# EAGLE design Catdoor-TwoMosfet-FeatherWing (EAGLE 8.3.2)
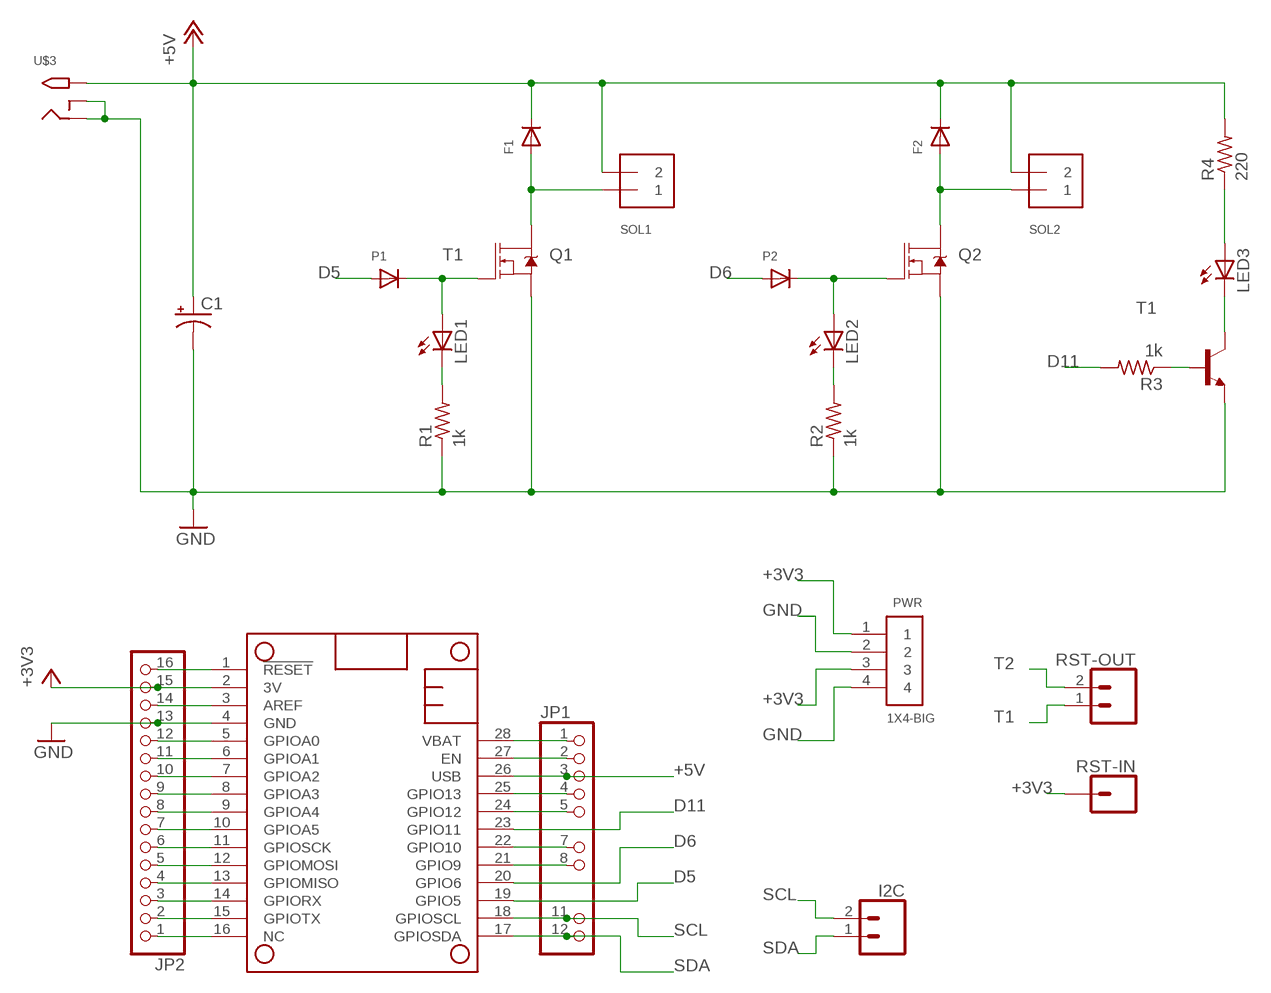
[diagram p0: schematic, sheet 1]

## Parts
C1  CPOL-USE5-13  [E5-13]
F1  DIODELONG-SPACING  [DIODE-LONG]
F2  DIODELONG-SPACING  [DIODE-LONG]
I2C  CONN_02  [1X02]
JP1  PINHD-1X12-CB  [1X12-CB]
JP2  HEADER-1X16ROUND  [1X16_ROUND]
LED1  LED3MM  [LED3MM]
LED2  LED3MM  [LED3MM]
LED3  LED3MM  [LED3MM]
MS1  FEATHERWING  [FEATHERWING]
P1  DIODELONG-SPACING  [DIODE-LONG]
P2  DIODELONG-SPACING  [DIODE-LONG]
PWR  1X4-BIG  [1X04-BIG]
Q1  MOSFET-NCH-FQP30N06L  [TO220V]
Q2  MOSFET-NCH-FQP30N06L  [TO220V]
R1  1k  R-US_0204/7  [0204/7]
R2  1k  R-US_0204/7  [0204/7]
R3  1k  R-US_0204/7  [0204/7]
R4  220  R-US_0204/7  [0204/7]
RST-IN  CONN_01  [1X01]
RST-OUT  CONN_02  [1X02]
SOL1  TERMBLOCK_1X2  [TERMBLOCK_1X2-3.5MM]
SOL2  TERMBLOCK_1X2  [TERMBLOCK_1X2-3.5MM]
T1  2N2222  [TO92-EBC-OVAL]
U$3  2.1MMJACKTHM  [PJ-102A]

## Nets
+3V3: JP2.15 MS1.2(3V) PWR.1 PWR.3 RST-IN.1
+5V: C1.+ F1.C F2.C JP1.3 MS1.26(USB) R4.2 SOL1.2 SOL2.2 U$3.TIP
D5: MS1.19(GPIO5) P1.A
D6: MS1.20(GPIO6) P2.A
D11: MS1.23(GPIO11) R3.2
GND: C1.- JP2.13 MS1.4(GND) PWR.2 PWR.4 Q1.3(S) Q2.3(S) R1.1 R2.1 T1.E U$3.RING U$3.RING_SW
N$1: JP1.2 MS1.27(EN)
N$2: JP1.4 MS1.25(GPIO13)
N$3: LED3.A R4.1
N$4: LED1.K(C) R1.2
N$5: JP1.5 MS1.24(GPIO12)
N$6: LED3.K(C) T1.C
N$7: R3.1 T1.B
N$9: LED2.K(C) R2.2
N$10: JP1.7 MS1.22(GPIO10)
N$11: JP1.8 MS1.21(GPIO9)
N$18: JP2.1 MS1.16(NC)
N$19: JP2.2 MS1.15(GPIOTX)
N$20: JP2.3 MS1.14(GPIORX)
N$21: JP2.4 MS1.13(GPIOMISO)
N$22: JP2.5 MS1.12(GPIOMOSI)
N$23: JP2.6 MS1.11(GPIOSCK)
N$24: JP2.7 MS1.10(GPIOA5)
N$25: JP2.8 MS1.9(GPIOA4)
N$26: JP2.9 MS1.8(GPIOA3)
N$27: JP2.10 MS1.7(GPIOA2)
N$28: JP2.11 MS1.6(GPIOA1)
N$29: JP2.12 MS1.5(GPIOA0)
N$30: JP2.14 MS1.3(AREF)
N$32: JP2.16 MS1.1(!RESET)
S1: F1.A Q1.2(D) SOL1.1
S2: F2.A Q2.2(D) SOL2.1
SCL: I2C.2 JP1.11 MS1.18(GPIOSCL)
SDA: I2C.1 JP1.12 MS1.17(GPIOSDA)
T1: LED1.A P1.C Q1.1(G) RST-OUT.1
T2: LED2.A P2.C Q2.1(G) RST-OUT.2
VBAT: JP1.1 MS1.28(VBAT)

## Library data of the parts
C1 = adafruit:CPOL-US: POLARIZED CAPACITOR, American symbol
F1 F2 P1 P2 = flupes:DIODE: Diode SMADIODE - SMA Surface Mount Package 20V 1A Schottky Diode Digikey: 641-1014-6-ND DO-1N4148 - Through Hole Small Current Diode SOD-123 20V 1 A (.5mV Vf) Schottky Diode - Digikey: MBRX120TPMSCT-ND SOD-323 10V 570mA (.38mV Vf, 3ns) Schottky Diode - Digikey: ZLLS410CT-ND SOD-523 30V 30mA Schottky Diode (RB751S-40TE61) - Digikey: RB751S-40TE61CT-ND SOT23-R/W - SOT23 Package (R = Solder Paste/Reflow Ovens, W = Hand-Soldering) BAT54Film 40V 300mA - Digikey: 497-7162-1-ND
I2C RST-OUT = SparkFun-Connectors:CONN_02: Multi connection point. Often used as Generic Header-pin footprint for 0.1 inch spaced/style header connections On any of the 0.1 inch spaced packages, you can populate with these: Break Away Headers - Straight <https://www.sparkfun.com/products/116> (PRT-00116) Break Away Male Headers - Right Angle <https://www.sparkfun.com/products/553> (PRT-00553) Female Headers <https://www.sparkfun.com/products/115> (PRT-00115) Break Away Headers - Machine Pin <https://www.sparkfun.com/products/117> (PRT-00117) Break Away Female Headers - Swiss Machine Pin <https://www.sparkfun.com/products/743> (PRT-00743) For SCREWTERMINALS and SPRING TERMINALS visit here: Screw Terimnals on SparkFun.com <https://www.sparkfun.com/search/results?term=Screw+Terminals> (5mm/3.5mm/2.54mm spacing) This device is also useful as a general connection point to wire up your design to another part of your project. Our various solder wires solder well into these plated through hole pads. Hook-Up Wire - Assortment (Stranded, 22 AWG) <https://www.sparkfun.com/products/11375> (PRT-11375) Hook-Up Wire - Assortment (Solid Core, 22 AWG) <https://www.sparkfun.com/products/11367> (PRT-11367) View the entire wire category on our website here <https://www.sparkfun.com/categories/141> Special notes: Molex polarized connector foot print use with: PRT-08233 with associated crimp pins and housings. 2.54_SCREWTERM for use with PRT-10571. 3.5mm Screw Terminal footprints for PRT-08084 5mm Screw Terminal footprints for use with PRT-08432
JP1 = flupes:PINHD-1X12: PIN HEADER
JP2 = microbuilder:HEADER-1X16: PIN HEADER
LED1-LED3 = adafruit:LED: LED OSRAM: - CHIPLED LG R971, LG N971, LY N971, LG Q971, LY Q971, LO R971, LY R971 LH N974, LH R974 LS Q976, LO Q976, LY Q976 LO Q996 - Hyper CHIPLED LW Q18S LB Q993, LB Q99A, LB R99A - SideLED LS A670, LO A670, LY A670, LG A670, LP A670 LB A673, LV A673, LT A673, LW A673 LH A674 LY A675 LS A676, LA A676, LO A676, LY A676, LW A676 LS A679, LY A679, LG A679 - Hyper Micro SIDELED® LS Y876, LA Y876, LO Y876, LY Y876 LT Y87S - SmartLED LW L88C, LW L88S LB L89C, LB L89S, LG L890 LS L89K, LO L89K, LY L89K LS L896, LA L896, LO L896, LY L896 - TOPLED LS T670, LO T670, LY T670, LG T670, LP T670 LSG T670, LSP T670, LSY T670, LOP T670, LYG T670 LG T671, LOG T671, LSG T671 LB T673, LV T673, LT T673, LW T673 LH T674 LS T676, LA T676, LO T676, LY T676, LB T676, LH T676, LSB T676, LW T676 LB T67C, LV T67C, LT T67C, LS T67K, LO T67K, LY T67K, LW E67C LS E67B, LA E67B, LO E67B, LY E67B, LB E67C, LV E67C, LT E67C LW T67C LS T679, LY T679, LG T679 LS T770, LO T770, LY T770, LG T770, LP T770 LB T773, LV T773, LT T773, LW T773 LH T774 LS E675, LA E675, LY E675, LS T675 LS T776, LA T776, LO T776, LY T776, LB T776 LHGB T686 LT T68C, LB T68C - Hyper Mini TOPLED® LB M676 - Mini TOPLED Santana® LG M470 LS M47K, LO M47K, LY M47K Source: http://www.osram.convergy.de/
MS1 = microbuilder:FEATHERWING
PWR = adafruit:1X4: 4-pin connector
Q1 Q2 = SparkFun-DiscreteSemi:MOSFET-NCH: N-channel MOSFETs Voltage controlled devices that allow control of high current outputs. SparkFun Products: SparkFun OpenScale <https://www.sparkfun.com/products/13261> SparkFun Digital Sandbox <https://www.sparkfun.com/products/12651> SparkFun Monster Moto Shield <https://www.sparkfun.com/products/10182> SparkFun MOSFET Power Controller <https://www.sparkfun.com/products/11214>; PROD_ID: TRANS-10060; VALUE: 60V/32A/35mΩ
R1-R4 = adafruit:R-US_: RESISTOR, American symbol
RST-IN = SparkFun-Connectors:CONN_01: Single connection point. Often used as Generic Header-pin footprint for 0.1 inch spaced/style header connections On any of the 0.1 inch spaced packages, you can populate with these: Break Away Headers - Straight <https://www.sparkfun.com/products/116> (PRT-00116) Break Away Male Headers - Right Angle <https://www.sparkfun.com/products/553> (PRT-00553) Female Headers <https://www.sparkfun.com/products/115> (PRT-00115) Break Away Headers - Machine Pin <https://www.sparkfun.com/products/117> (PRT-00117) Break Away Female Headers - Swiss Machine Pin <https://www.sparkfun.com/products/743> (PRT-00743) This device is also useful as a general connection point to wire up your design to another part of your project. Our various solder wires solder well into these plated through hole pads. Hook-Up Wire - Assortment (Stranded, 22 AWG) <https://www.sparkfun.com/products/11375> (PRT-11375) Hook-Up Wire - Assortment (Solid Core, 22 AWG) <https://www.sparkfun.com/products/11367> (PRT-11367) View the entire wire category on our website here <https://www.sparkfun.com/categories/141> Special notes: SMTSO-256-ET is a "flush mount" nut for a 4-40 screw. We mostly use this on specialty testbeds; it is a nice way to connect hardware to your PCB at an adjustable hieght. Also note, the SNAP packages are for using a snappable style connector. We sell a baggie of snaps and they are also used on two LilyPad designs: Snap Assortment - 30 pack (male and female) <https://www.sparkfun.com/products/11347> (DEV-11347) LilyPad Arduino SimpleSnap <https://www.sparkfun.com/products/10941> (DEV-10941) LilyPad SimpleSnap Protoboard <https://www.sparkfun.com/products/10940> (DEV-10940)
SOL1 SOL2 = microbuilder:TERMBLOCK_1X2: 3.5mm Terminal block http://www.ladyada.net/library/pcb/eaglelibrary.html
T1 = adafruit:2N2222: NPN TRANSISTOR Big oval pads
U$3 = adafruit:2.1MMJACK: 2.1mm x 5.5mm THM DC jack with internal switch. Digikey part #PJ-102A, 4UCON part #05537 2.1mm x 5.5mm SMT DC jack with internal switch. Digikey part #PJ-002A-SMT, 4UCON part #03267 By microbuilder.eu & adafruit.com

## Board
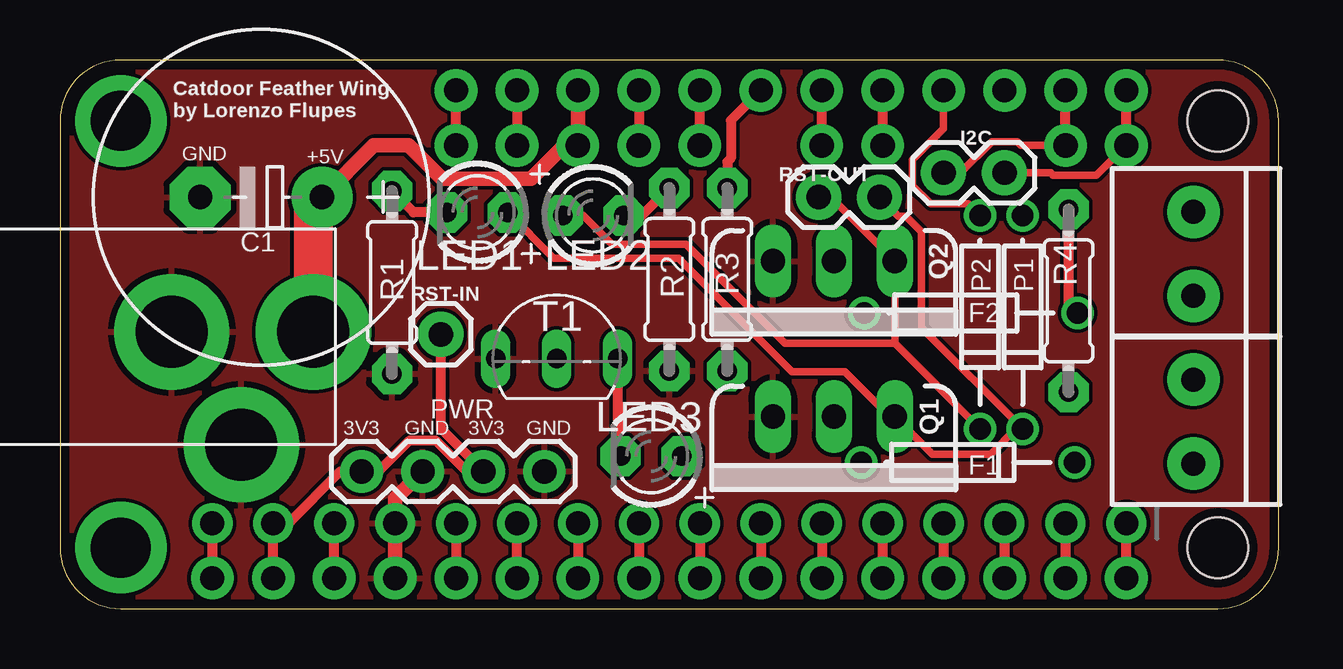
[diagram p1: board, top side]
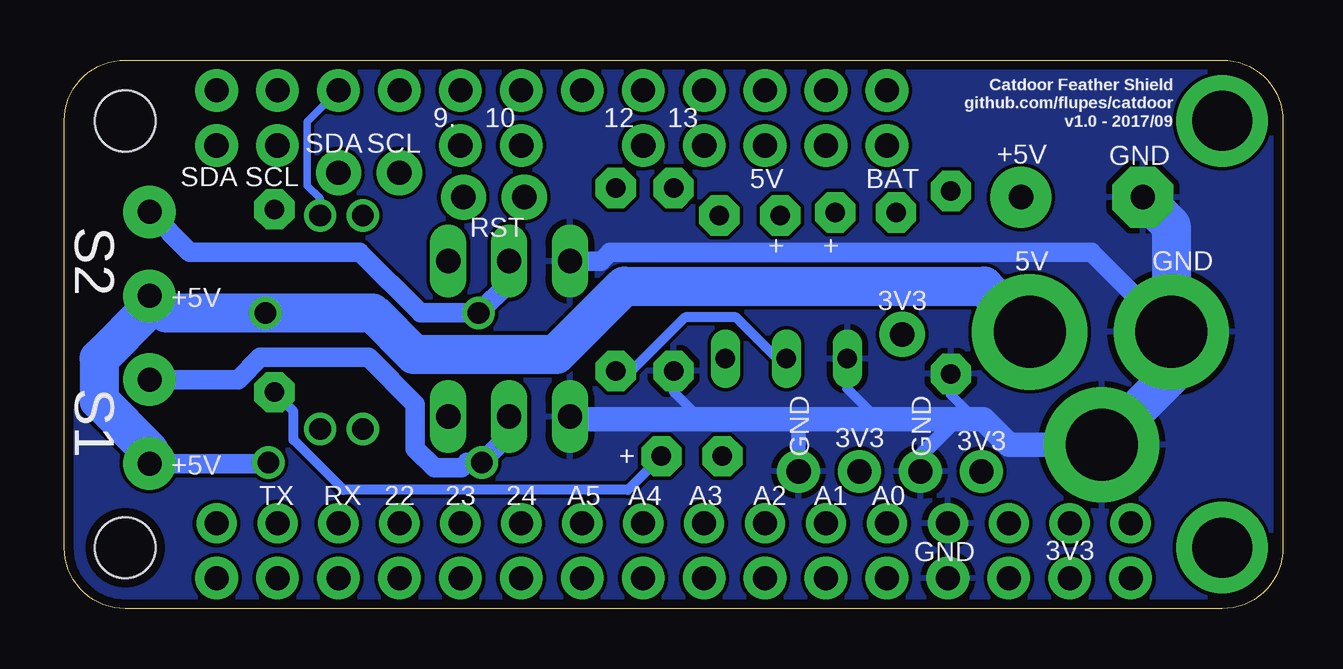
[diagram p2: board, bottom side, seen from below]

Size 50.8 x 22.86 mm. Coordinates in mm from the lower left corner, seen from the top.
Copper layers (1*16): Top 0.0356mm / dielectric 1.5011mm / Bottom 0.0356mm
Design rules "oshpark-2layer": minimum track width 6mil, minimum drill 13mil, track to track 6mil, track to pad 6mil, pad to pad 6mil, via to via 6mil, smd to smd 6mil, copper to edge 15mil, drill to drill 6mil, minimum pad ring 7mil, minimum via ring 7mil, stop-mask expansion 2.5mil, vias tented up to drill 0mil, thermal gap 10mil

### Footprints (pad centres in the part's own frame; a part is rotated, then mirrored left to right if it is on the bottom)
E5-13 = drill 1.016 pad 2.54: + -2.54,0 | drill 1.016 pad 2.54 octagon: - 2.54,0
DIODE-LONG = drill 0.9: A -3.81,0; C 5.08,0
1X02 = drill 1.016 pad 1.88: 1 0,0; 2 2.54,0
1X12-CB = drill 1.016 pad 1.778: 1 -13.97,0; 2 -11.43,0; 3 -8.89,0; 4 -6.35,0; 5 -3.81,0; 7 1.27,0; 8 3.81,0; 11 11.43,0; 12 13.97,0
1X16_ROUND = drill 1 pad 1.676: 1 -19.05,0; 2 -16.51,0; 3 -13.97,0; 4 -11.43,0; 5 -8.89,0; 6 -6.35,0; 7 -3.81,0; 8 -1.27,0; 9 1.27,0; 10 3.81,0; 11 6.35,0; 12 8.89,0; 13 11.43,0; 14 13.97,0; 15 16.51,0; 16 19.05,0
LED3MM = drill 0.813 pad 1.676 octagon: A -1.27,0; K 1.27,0
FEATHERWING = drill 1 pad 1.778: 1 6.35,1.27; 2 8.89,1.27; 3 11.43,1.27; 4 13.97,1.27; 5 16.51,1.27; 6 19.05,1.27; 7 21.59,1.27; 8 24.13,1.27; 9 26.67,1.27; 10 29.21,1.27; 11 31.75,1.27; 12 34.29,1.27; 13 36.83,1.27; 14 39.37,1.27; 15 41.91,1.27; 16 44.45,1.27; 17 44.45,21.59; 18 41.91,21.59; 19 39.37,21.59; 20 36.83,21.59; 21 34.29,21.59; 22 31.75,21.59; 23 29.21,21.59; 24 26.67,21.59; 25 24.13,21.59; 26 21.59,21.59; 27 19.05,21.59; 28 16.51,21.59 | drill 2.5 pad 3.81: P$1 2.54,20.32; P$2 2.54,2.54 | hole 2.54: 48.26,20.32; 48.26,2.54
1X04-BIG = drill 1.016 pad 1.778: 1 0,0; 2 2.54,0; 3 5.08,0; 4 7.62,0
TO220V = drill 1.016 long: 1 -2.54,0; 2 0,0; 3 2.54,0
0204/7 = drill 0.813 pad 1.676 octagon: 1 -3.81,0; 2 3.81,0
1X01 = drill 1.016 pad 1.88: 1 0,0
TERMBLOCK_1X2-3.5MM = drill 1 pad 2.184: 1 1.8,0; 2 -1.7,0
TO92-EBC-OVAL = drill 0.813 long: B 0,-1.27; C 2.54,-1.27; E -2.54,-1.27
PJ-102A = drill 3 pad 4.8: RING 0.1,-3.39; RING_SW -4.6,-6.29; TIP 0.1,-9.29

### Placement (x,y rotation side)
C1  8.38,17.14 180 top
F1  37.21,6.1 0 top
F2  37.34,12.32 0 top
I2C  39.37,18.16 180 top
JP1  30.48,19.3 0 top
JP2  25.4,3.56 180 top
LED1  17.4,16.51 180 top
LED2  22.23,16.38 0 top
LED3  24.64,6.35 180 top
MS1  0,0 0 top
P1  40.13,12.57 270 top
P2  38.35,12.57 270 top
PWR  12.57,5.71 0 top
Q1  32.26,8 180 top
Q2  32.26,14.48 180 top
R1  13.84,13.59 90 top
R2  25.4,13.72 90 top
R3  27.81,13.72 90 top
R4  42.04,12.83 90 top
RST-IN  15.88,11.43 0 top
RST-OUT  34.16,17.14 180 top
SOL1  47.24,7.75 90 top
SOL2  47.24,14.73 90 top
T1  20.7,11.68 0 top
U$3  1.27,11.43 90 top

### Tracks (layer width: path | path; a pad name or v marks a point on that pad's centre or on a via)
+3V3
  Top 0.406: MS1.2 JP2.15 9.53,3.56 11.68,5.71 PWR.1 13.28,5.71 14.58,7.01 15.65,7.01 16.95,5.71 PWR.3 15.88,7.49 RST-IN.1
+5V
  Top 0.406: R4.2 42.04,12.7 F2.C
  Top 0.61: MS1.26 JP1.3 21.03,19.3 19.63,17.91 15.93,17.91 14.53,19.3 13.08,19.3 C1.+
  Top 1.626: C1.+ 10.56,16.78 U$3.TIP
  Bottom 0.813: F1.C 42.34,6.05 SOL1.2
  Bottom 1.626: U$3.TIP 12.47,13.44 27.46,13.44 30.3,10.6 36.23,10.6 37.95,12.32 F2.C 46.53,12.32 SOL2.2 47.24,12.53 49.35,10.42 49.35,8.67 47.24,6.57 SOL1.2
D5
  Bottom 0.305: P1.A 40.13,17.09 40.66,17.62 40.66,20.3 MS1.19
D6
  Top 0.305: P2.A 37.87,16.87 36.29,16.87 35.53,17.62 35.53,18.7 36.83,19.99 MS1.20
D11
  Top 0.406: R3.2 27.81,18.61 27.96,18.77 27.96,20.34 MS1.23
GND
  Top 0.61: MS1.4 JP2.13 13.97,4.57 PWR.2
  Bottom 0.406: R1.1 13.84,8.91 12.83,7.9 | R2.1 25.4,9.04 24.26,7.9 | T1.E 18.16,9.17 16.89,7.9
  Bottom 0.61: PWR.4 20.19,7.77 20.32,7.9 | PWR.2 15.11,6.38 13.59,7.9
  Bottom 0.813: Q2.3 28.43,14.48 28.05,14.86 7.99,14.86 U$3.RING
  Bottom 1.016: U$3.RING_SW 11.43,6.83 12.49,7.9 12.83,7.9 13.59,7.9 16.89,7.9 20.32,7.9 24.26,7.9 29.62,7.9 Q1.3
  Bottom 1.626: U$3.RING_SW 4.66,9.73 U$3.RING 4.66,15.96 C1.-
  pour Bottom: 0,22.86 0,0 50.8,0 50.8,22.86
  pour Top: 0,22.86 0,0 50.8,0 50.8,22.86
N$1
  Top 0.406: MS1.27 JP1.2
N$2
  Top 0.406: MS1.25 JP1.4
N$3
  Bottom 0.406: LED3.A 27.3,4.95 39.16,4.95 41.24,7.03 41.24,8.22 R4.1
N$4
  Top 0.406: LED1.K 14.73,16.51 R1.2
N$5
  Top 0.406: JP1.5 MS1.24
N$6
  Top 0.406: T1.C 23.24,6.48 LED3.K
N$7
  Bottom 0.406: R3.1 27.16,9.91 24.93,12.14 22.8,12.14 21.07,10.41 T1.B
N$9
  Top 0.406: LED2.K 24.26,16.38 R2.2
N$10
  Top 0.406: JP1.7 MS1.22
N$11
  Top 0.406: MS1.21 JP1.8
N$18
  Top 0.406: MS1.16 JP2.1
N$19
  Top 0.406: JP2.2 MS1.15
N$20
  Top 0.406: JP2.3 MS1.14
N$21
  Top 0.406: JP2.4 MS1.13
N$22
  Top 0.406: JP2.5 MS1.12
N$23
  Top 0.406: JP2.6 MS1.11
N$24
  Top 0.406: JP2.7 MS1.10
N$25
  Top 0.406: JP2.8 MS1.9
N$26
  Top 0.406: JP2.9 MS1.8
N$27
  Top 0.406: JP2.10 MS1.7
N$28
  Top 0.406: MS1.6 JP2.11
N$29
  Top 0.406: JP2.12 MS1.5
N$30
  Top 0.406: MS1.3 JP2.14
N$32
  Top 0.406: JP2.16 MS1.1
S1
  Bottom 0.813: SOL1.1 43.55,9.55 42.64,10.46 38.11,10.46 36.17,8.52 36.17,6.67 35.37,5.87 34.23,5.87 34,6.1 F1.A 32.26,7.24 Q1.2
S2
  Bottom 0.813: SOL2.1 45.57,14.86 38.48,14.86 35.94,12.32 F2.A 32.26,13.59 Q2.2
SCL
  Top 0.305: I2C.2 37.54,18.16 38.83,19.46 39.91,19.46 40.06,19.3 JP1.11
  Top 0.406: JP1.11 MS1.18
SDA
  Top 0.305: I2C.1 41.29,18.16 41.39,18.06 43.2,18.06 JP1.12
  Top 0.406: JP1.12 MS1.17
T1
  Top 0.305: LED1.A 20.57,14.61 25.78,14.61 30.5,9.88 32.72,9.88 34.6,8 Q1.1 36.37,6.43 38.79,6.43 39.85,7.49 P1.C 35.92,11.71 35.92,15.7 35.26,16.36 34.95,16.36 RST-OUT.1
T2
  Top 0.305: 34.8,11.05 P2.C | 34.8,11.05 Q2.1 32.13,17.14 RST-OUT.2 | LED2.A 21.81,16.38 23,15.19 26.09,15.19 30.23,11.05 34.8,11.05
VBAT
  Top 0.406: JP1.1 MS1.28

### Text on the board
tPlace: Catdoor Feather Wing / by Lorenzo Flupes
bPlace: Catdoor Feather Shield / github.com/flupes/catdoor / v1.0 - 2017/09 | 13 | 12 | 10 | 9. | SCL | SDA | GND | +5V | BAT | 5V | SCL | SDA | + | + | RST | GND | 5V | S2 | +5V | 3V3 | GND | GND | S1 | 3V3 | 3V3 | + | +5V | A0 | A1 | A2 | A3 | A4 | A5 | 24 | 23 | 22 | RX | TX | GND | 3V3
tNames: GND | +5V | 3V3 | GND | 3V3 | GND